# EAGLE schematic template (EAGLE 8.6.0)

## Sheet 1 of 2
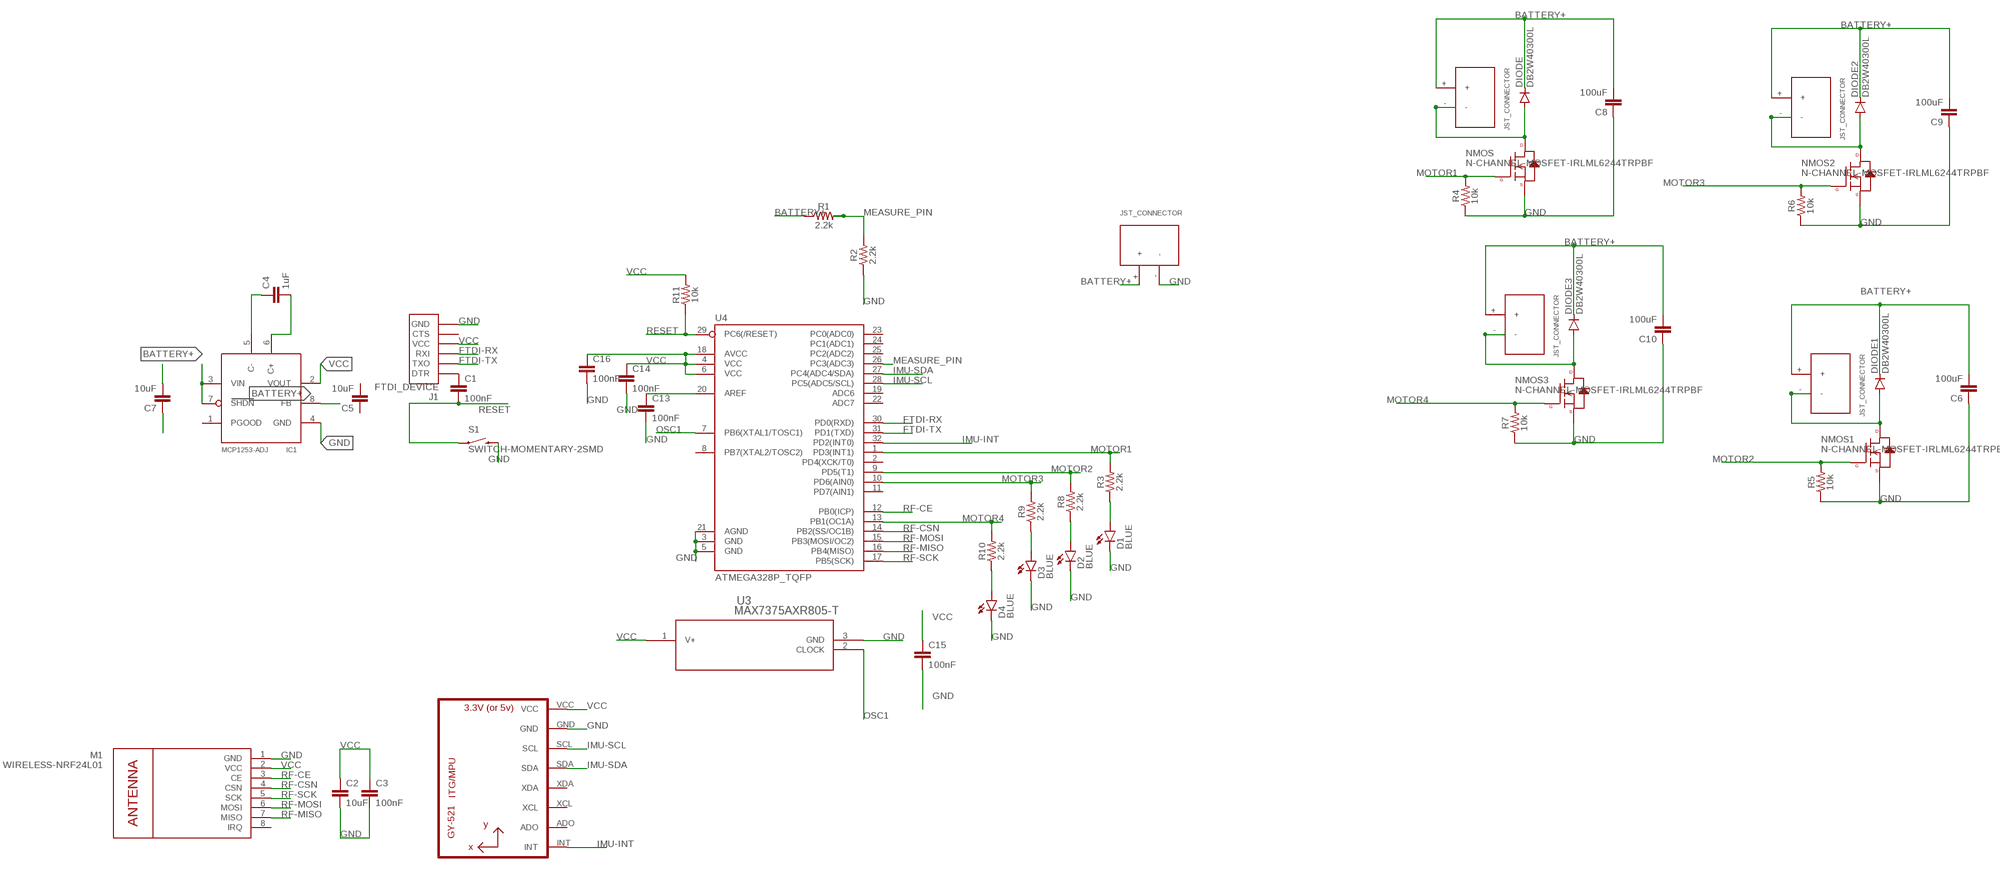
[diagram p0: schematic, sheet 1]

### Parts
C1  100nF  0.1UF-25V(+80/-20%)(0603)  [0603-CAP]
C2  10uF  CAP0603-CAP  [0603-CAP]
C3  100nF  CAP0603-CAP  [0603-CAP]
C4  1uF  0.1UF-25V(+80/-20%)(0603)  [0603-CAP]
C5  10uF  0.1UF-25V(+80/-20%)(0603)  [0603-CAP]
C6  100uF  CAP1206  [1206]
C7  10uF  0.1UF-25V(+80/-20%)(0603)  [0603-CAP]
C8  100uF  CAP1206  [1206]
C9  100uF  CAP1206  [1206]
C10  100uF  CAP1206  [1206]
C13  100nF  CAP0603-CAP  [0603-CAP]
C14  100nF  CAP0603-CAP  [0603-CAP]
C15  100nF  0.1UF-25V(+80/-20%)(0603)  [0603-CAP]
C16  100nF  CAP0603-CAP  [0603-CAP]
D1  BLUE  LED-BLUE0603  [LED-0603]
D2  BLUE  LED-BLUE0603  [LED-0603]
D3  BLUE  LED-BLUE0603  [LED-0603]
D4  BLUE  LED-BLUE0603  [LED-0603]
DIODE  DB2W40300L  [MINI2-F3-B]
DIODE1  DB2W40300L  [MINI2-F3-B]
DIODE2  DB2W40300L  [MINI2-F3-B]
DIODE3  DB2W40300L  [MINI2-F3-B]
IC1  MCP1253-ADJ  [MSOP8]
J1  FTDI_DEVICE  [FTDI_DEVICE_SIDE]
M1  WIRELESS-NRF24L01  [WIRELESS-NRF24L01]
MOTOR1  JST_CONNECTOR_FEMALE  [JST_CONNECTOR_FEMALE]
MOTOR2  JST_CONNECTOR_FEMALE  [JST_CONNECTOR_FEMALE]
MOTOR3  JST_CONNECTOR_FEMALE  [JST_CONNECTOR_FEMALE]
MOTOR4  JST_CONNECTOR_FEMALE  [JST_CONNECTOR_FEMALE]
NMOS  N-CHANNEL-MOSFET-IRLML6244TRPBF  [SOT23-3]
NMOS1  N-CHANNEL-MOSFET-IRLML6244TRPBF  [SOT23-3]
NMOS2  N-CHANNEL-MOSFET-IRLML6244TRPBF  [SOT23-3]
NMOS3  N-CHANNEL-MOSFET-IRLML6244TRPBF  [SOT23-3]
R1  2.2k  2.2KOHM-0603-1/10W-1%  [0603]
R2  2.2k  2.2KOHM-0603-1/10W-1%  [0603]
R3  2.2k  2.2KOHM-0603-1/10W-1%  [0603]
R4  10k  2.2KOHM-0603-1/10W-1%  [0603]
R5  10k  2.2KOHM-0603-1/10W-1%  [0603]
R6  10k  2.2KOHM-0603-1/10W-1%  [0603]
R7  10k  2.2KOHM-0603-1/10W-1%  [0603]
R8  2.2k  2.2KOHM-0603-1/10W-1%  [0603]
R9  2.2k  2.2KOHM-0603-1/10W-1%  [0603]
R10  2.2k  2.2KOHM-0603-1/10W-1%  [0603]
R11  10k  2.2KOHM-0603-1/10W-1%  [0603]
S1  SWITCH-MOMENTARY-2SMD  [TACTILE-SWITCH-SMD]
U2  GY-521MPU6050  [GY-521]
U3  MAX7375AXR805-T  [21-0075D]
U4  ATMEGA328P_TQFP  [TQFP32-08]
U$1  JST_CONNECTOR_FEMALE  [JST_CONNECTOR_FEMALE]

### Nets
BATTERY+: C6.2 C7.2 C8.2 C9.2 C10.2 DIODE1.NEG(GPIN) DIODE2.NEG(GPIN) DIODE3.NEG(GPIN) DIODE.NEG(GPIN) IC1.3(VIN) IC1.7(SHDN) IC1.8(FB) MOTOR1.+ MOTOR2.+ MOTOR3.+ MOTOR4.+ R1.1 U$1.+
FTDI-RX: J1.P$3(RXI) U4.30(PD0(RXD))
FTDI-TX: J1.P$2(TXO) U4.31(PD1(TXD))
GND: C2.2 C3.2 C6.1 C7.1 C8.1 C9.1 C10.1 C13.2 C14.2 C15.2 C16.2 D1.C D2.C D3.C D4.C IC1.4(GND) J1.P$6(GND) M1.1(GND) NMOS1.2(S) NMOS2.2(S) NMOS3.2(S) NMOS.2(S) R2.1 R4.1 R5.1 R6.1 R7.1 S1.3 U2.GND U3.3(GND) U4.3(GND) U4.5(GND) U4.21(AGND) U$1.-
IMU-INT: U2.INT U4.32(PD2(INT0))
IMU-SCL: U2.SCL U4.28(PC5(ADC5/SCL))
IMU-SDA: U2.SDA U4.27(PC4(ADC4/SDA))
MEASURE_PIN: R1.2 R2.2 U4.26(PC3(ADC3))
MOTOR1: NMOS.1(G) R3.2 R4.2 U4.1(PD3(INT1))
MOTOR2: NMOS1.1(G) R5.2 R8.2 U4.9(PD5(T1))
MOTOR3: NMOS2.1(G) R6.2 R9.2 U4.10(PD6(AIN0))
MOTOR4: NMOS3.1(G) R7.2 R10.2 U4.13(PB1(OC1A))
N$1: D4.A R10.1
N$2: C1.1 J1.P$1(DTR)
N$3: D3.A R9.1
N$4: DIODE1.POS(PPIN) MOTOR2.- NMOS1.3(D)
N$5: DIODE2.POS(PPIN) MOTOR3.- NMOS2.3(D)
N$6: DIODE.POS(PPIN) MOTOR1.- NMOS.3(D)
N$7: DIODE3.POS(PPIN) MOTOR4.- NMOS3.3(D)
N$8: C4.1 IC1.5(C-)
N$9: C4.2 IC1.6(C+)
N$10: D2.A R8.1
N$11: D1.A R3.1
N$15: C13.1 U4.20(AREF)
OSC1: U3.2(CLOCK) U4.7(PB6(XTAL1/TOSC1))
RESET: C1.2 R11.1 S1.1 U4.29(PC6(/RESET))
RF-CE: M1.3(CE) U4.12(PB0(ICP))
RF-CSN: M1.4(CSN) U4.14(PB2(SS/OC1B))
RF-MISO: M1.7(MISO) U4.16(PB4(MISO))
RF-MOSI: M1.6(MOSI) U4.15(PB3(MOSI/OC2))
RF-SCK: M1.5(SCK) U4.17(PB5(SCK))
VCC: C2.1 C3.1 C14.1 C15.1 C16.1 IC1.2(VOUT) J1.P$4(VCC) M1.2(VCC) R11.2 U2.VCC U3.1(V+) U4.4(VCC) U4.6(VCC) U4.18(AVCC)
Unconnected: C5.1 C5.2 IC1.1(PGOOD) J1.P$5(CTS) M1.8(IRQ) U2.ADO U2.XCL U2.XDA U4.2(PD4(XCK/T0)) U4.8(PB7(XTAL2/TOSC2)) U4.11(PD7(AIN1)) U4.19(ADC6) U4.22(ADC7) U4.23(PC0(ADC0)) U4.24(PC1(ADC1)) U4.25(PC2(ADC2))

## Sheet 2 of 2

## Library data of the parts
C1 C4 C5 C7 C15 = SparkFun-Capacitors:0.1UF-25V(+80/-20%)(0603): CAP-00810 Ceramic Standard decoupling cap; PROD_ID: CAP-00810; VALUE: 0.1uF
C2 C3 C6 C8-C10 C13 C14 C16 = SparkFun-Passives:CAP: Capacitor Standard 0603 ceramic capacitor, and 0.1" leaded capacitor.
D1 = LEDs:LED-BLUE: Blue LEDs for production use Various blue LEDs stocked by SparkFun production 0603 - DIO-08575 Rebel - DIO-09553 1206 - DIO-09911; PROD_ID: DIO-08575; SPICEPREFIX: D
D2-D4 = LEDs:LED-BLUE: Blue LEDs for production use Various blue LEDs stocked by SparkFun production 0603 - DIO-08575 Rebel - DIO-09553 1206 - DIO-09911; PROD_ID: DIO-08575
DIODE DIODE1-DIODE3 = quad:DB2W40300L
IC1 = microchip:MCP1253-ADJ: 1MHz Adjustable Switching Regulator
J1 = quad:FTDI_DEVICE: Connector which mates to FTDI basic or FTDI cable.
M1 = quad:WIRELESS-NRF24L01: 2.4 GHz Wireless Module based on NRF24L01 chip
MOTOR1-MOTOR4 U$1 = quad:JST_CONNECTOR_FEMALE
NMOS NMOS1-NMOS3 = quad:N-CHANNEL-MOSFET: N-Channel MOSFET Mode Field Effect Transistor; DATASHEET: http://www.mouser.com/ds/2/196/irlml6244pbf-936666.pdf; MOUSER: 942-IRLML6244TRPBF; URL: http://www.mouser.com/Search/ProductDetail.aspx?R=IRLML6244TRPBFvirtualkey57370000virtualkey942-IRLML6244TRPBF
R1 R2 R8-R10 = SparkFun-Resistors:2.2KOHM: 2.2kΩ resistor A resistor is a passive two-terminal electrical component that implements electrical resistance as a circuit element. Resistors act to reduce current flow, and, at the same time, act to lower voltage levels within circuits. - Wikipedia; PROD_ID: RES-08272
R3 = SparkFun-Resistors:2.2KOHM: 2.2kΩ resistor A resistor is a passive two-terminal electrical component that implements electrical resistance as a circuit element. Resistors act to reduce current flow, and, at the same time, act to lower voltage levels within circuits. - Wikipedia; PROD_ID: RES-08272; SPICEPREFIX: R
R4-R7 R11 = SparkFun-Resistors:2.2KOHM: 2.2kΩ resistor A resistor is a passive two-terminal electrical component that implements electrical resistance as a circuit element. Resistors act to reduce current flow, and, at the same time, act to lower voltage levels within circuits. - Wikipedia; PROD_ID: RES-08272; VALUE: 2.2k
S1 = quad:SWITCH-MOMENTARY-2: Various NO switches- pushbuttons, reed, etc; PROD_ID: SWCH-08247
U2 = quad:GY-521
U3 = MAX7375AXR805-T:MAX7375AXR805-T; AVAILABILITY: Good; DESCRIPTION: OSCILLATOR MEMS 8MHZ CMOS SMD; MF: Maxim Integrated; MP: MAX7375AXR805+T; PACKAGE: SC-70 Maxim Integrated; PRICE: 1.06 USD
U4 = quad:ATMEGA328P_TQFP; PROD_ID: IC-09069